# EAGLE design compact (EAGLE 7.1.0)
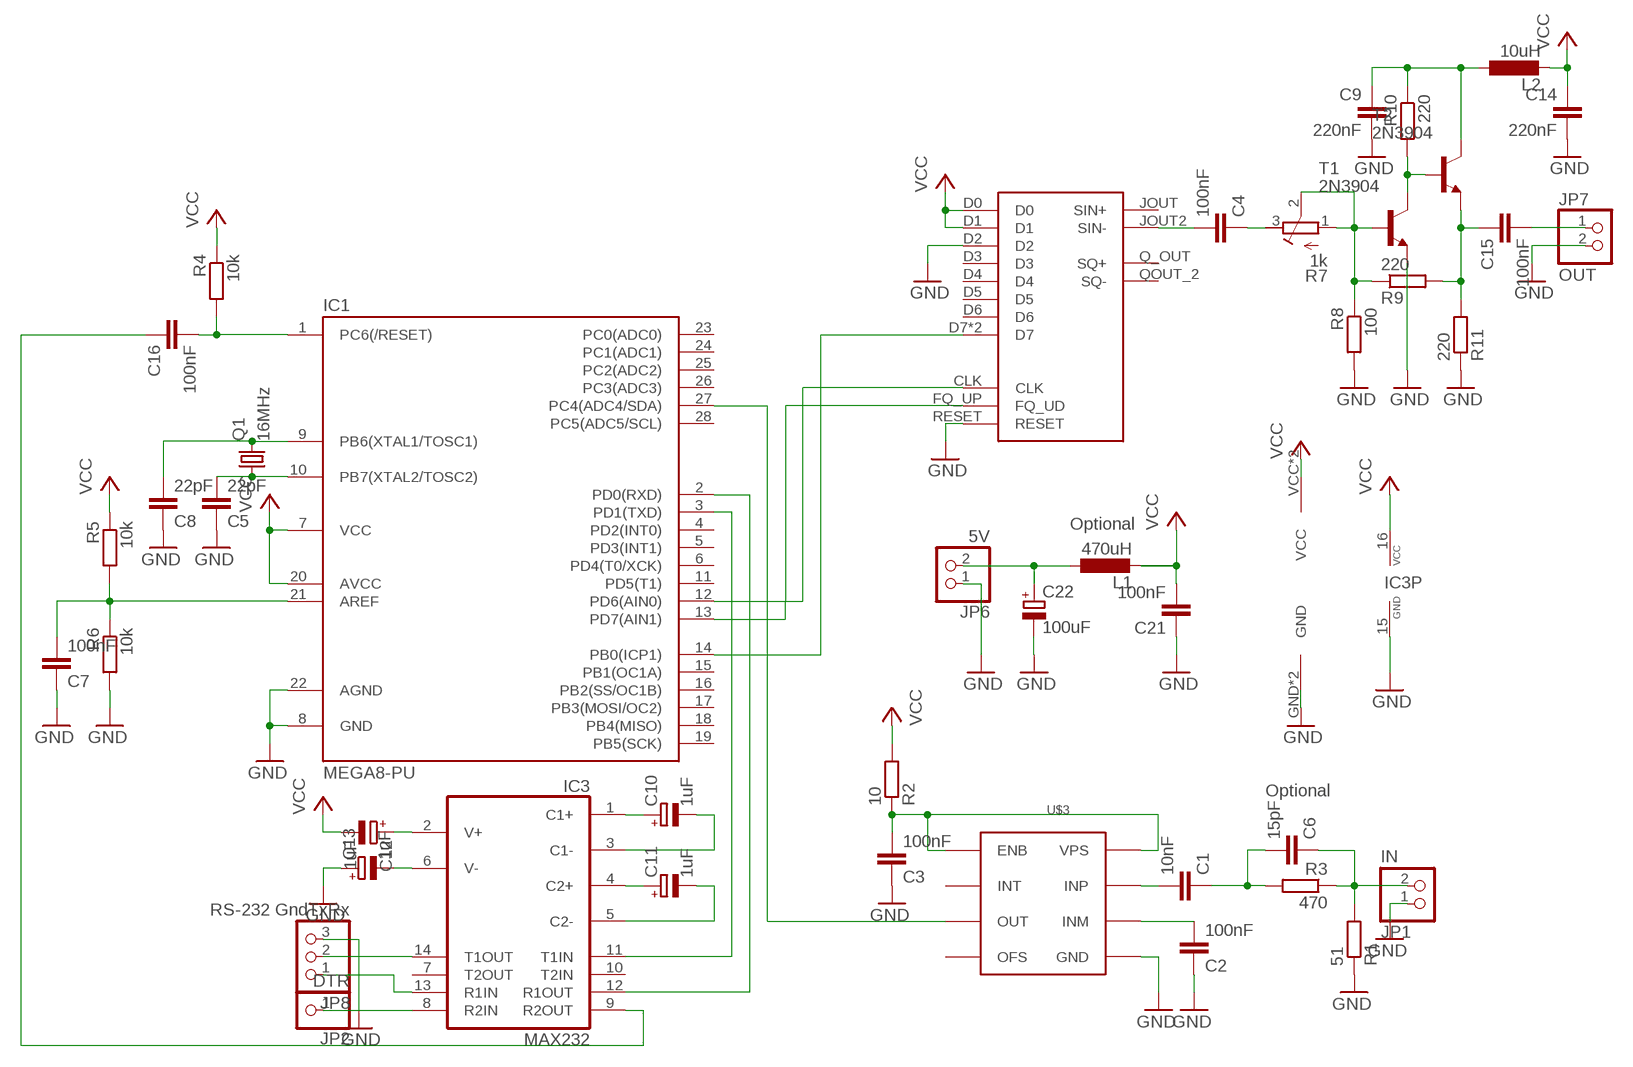
[diagram p0: schematic, sheet 1]

## Parts
C1  10nF  C-EU050-025X075  [C050-025X075]
C2  100nF  C-EU025-025X050  [C025-025X050]
C3  100nF  C-EU025-025X050  [C025-025X050]
C4  100nF  C-EU025-025X050  [C025-025X050]
C5  22pF  C-EU102-043X133  [C102-043X133]
C6  15pF  C-EU025-025X050  [C025-025X050]
C7  100nF  C-EU025-025X050  [C025-025X050]
C8  22pF  C-EU025-025X050  [C025-025X050]
C9  220nF  C-EU025-025X050  [C025-025X050]
C10  1uF  CPOL-EUE2.5-6  [E2,5-6]
C11  1uF  CPOL-EUE2.5-5  [E2,5-5]
C12  1uF  CPOL-EUE2.5-5  [E2,5-5]
C13  1uF  CPOL-EUE5-5  [E5-5]
C14  220nF  C-EU025-025X050  [C025-025X050]
C15  100nF  C-EU050-025X075  [C050-025X075]
C16  100nF  C-EU075-032X103  [C075-032X103]
C21  100nF  C-EU025-025X050  [C025-025X050]
C22  100uF  CPOL-EUE2.5-6  [E2,5-6]
IC1  MEGA8-PU  [DIL28-3]
IC3  MAX232  [DIL16]
JP1  IN  PINHD-1X2  [1X02]
JP2  DTR  PINHD-1X1  [1X01]
JP6  5V  PINHD-1X2  [1X02]
JP7  OUT  PINHD-1X2  [1X02]
JP8  RS-232 GndTxRx  PINHD-1X3  [1X03]
L1  470uH  L-EU0207/5V  [0207/5V]
L2  10uH  L-EU0204/7  [0204/7]
Q1  16MHz  CRYSTALHC49U-V  [HC49U-V]
R1  51  R-EU_0204/2V  [0204V]
R2  10  R-EU_0204/5  [0204/5]
R3  470  R-EU_0204/2V  [0204V]
R4  10k  R-EU_0204/5  [0204/5]
R5  10k  R-EU_0204/2V  [0204V]
R6  10k  R-EU_0204/5  [0204/5]
R7  1k  R-TRIMM74W  [RTRIM74W]
R8  100  R-EU_0204/2V  [0204V]
R9  220  R-EU_0204/2V  [0204V]
R10  220  R-EU_0204/2V  [0204V]
R11  220  R-EU_0204/2V  [0204V]
T1  2N3904  2N3904-NPN-TO92-EBC  [TO92-EBC]
T2  2N3904  2N3904-NPN-TO92-EBC  [TO92-EBC]
U$1  DDS-1  [DDS-1]
U$3  AD8307  [DIL08]

## Nets
GND: C2.1 C3.1 C5.1 C7.1 C8.1 C9.2 C13.+ C14.2 C21.1 C22.- IC1.8(GND) IC1.22(AGND) IC3.15(GND) JP1.1 JP6.1 JP7.2 JP8.3 R1.1 R6.2 R8.2 R11.1 T1.E U$1.D2 U$1.GND U$1.GND2(GND) U$1.RESET U$3.2(GND)
N$1: C4.2 U$1.JOUT2(SIN-)
N$2: C6.1 JP1.2 R1.2 R3.1
N$3: C1.2 U$3.8(INP)
N$4: C2.2 U$3.1(INM)
N$5: C5.2 IC1.10(PB7(XTAL2/TOSC2)) Q1.1
N$6: C8.2 IC1.9(PB6(XTAL1/TOSC1)) Q1.2
N$7: C12.+ IC3.2(V+)
N$8: C3.2 R2.1 U$3.6(ENB) U$3.7(VPS)
N$9: IC1.27(PC4(ADC4/SDA)) U$3.4(OUT)
N$10: C22.+ JP6.2 L1.1
N$11: IC3.14(T1OUT) JP8.2
N$12: C1.1 C6.2 R3.2
N$13: C4.1 R7.3(A)
N$14: R7.1(E) R7.2(S) R8.1 R9.1 T1.B
N$15: IC1.13(PD7(AIN1)) U$1.FQ_UP(FQ_UD)
N$16: C13.- IC3.6(V-)
N$17: IC1.3(PD1(TXD)) IC3.11(T1IN)
N$18: IC1.12(PD6(AIN0)) U$1.CLK
N$19: IC1.14(PB0(ICP1)) U$1.D7 U$1.D7_2(D7)
N$20: C9.1 L2.1 R10.1 T2.C
N$21: R10.2 T1.C T2.B
N$22: IC1.2(PD0(RXD)) IC3.12(R1OUT)
N$23: C15.2 JP7.1
N$24: C15.1 R9.2 R11.2 T2.E
N$25: C16.2 IC1.1(PC6(/RESET)) R4.2
N$26: C16.1 IC3.9(R2OUT)
N$27: IC3.8(R2IN) JP2.1
N$29: C7.2 IC1.21(AREF) R5.2 R6.1
N$34: IC3.13(R1IN) JP8.1
N$38: C10.+ IC3.1(C1+)
N$39: C10.- IC3.3(C1-)
N$40: C11.+ IC3.4(C2+)
N$41: C11.- IC3.5(C2-)
VCC: C12.- C14.1 C21.2 IC1.7(VCC) IC1.20(AVCC) IC3.16(VCC) L1.2 L2.2 R2.2 R4.1 R5.1 U$1.D0 U$1.D1 U$1.VCC U$1.VCC2(VCC)
Unconnected: IC1.4(PD2(INT0)) IC1.5(PD3(INT1)) IC1.6(PD4(T0/XCK)) IC1.11(PD5(T1)) IC1.15(PB1(OC1A)) IC1.16(PB2(SS/OC1B)) IC1.17(PB3(MOSI/OC2)) IC1.18(PB4(MISO)) IC1.19(PB5(SCK)) IC1.23(PC0(ADC0)) IC1.24(PC1(ADC1)) IC1.25(PC2(ADC2)) IC1.26(PC3(ADC3)) IC1.28(PC5(ADC5/SCL)) IC3.7(T2OUT) IC3.10(T2IN) U$1.D3 U$1.D4 U$1.D5 U$1.D6 U$1.JOUT(SIN+) U$1.Q_OUT(SQ+) U$1.QOUT_2(SQ-) U$3.3(OFS) U$3.5(INT)

## Notes on the sheet
- Optional
- Optional

## Library data of the parts
C1-C9 C14-C16 C21 = rcl:C-EU: CAPACITOR, European symbol
C10-C13 C22 = rcl:CPOL-EU: POLARIZED CAPACITOR, European symbol
IC1 = avr-6:MEGA8-PU
IC3 = maxim:MAX232: RS232 TRANSCEIVER; MF: MAXIM; MPN: MAX232ACPE+; OC_FARNELL: 9723773; OC_NEWARK: 68K4544
JP1 JP6 JP7 = pinhead:PINHD-1X2: PIN HEADER
JP2 = pinhead:PINHD-1X1: PIN HEADER
JP8 = pinhead:PINHD-1X3: PIN HEADER
L1 L2 = rcl:L-EU: INDUCTOR, European symbol
Q1 = crystal:CRYSTAL: CRYSTAL; OC_FARNELL: 1666969; OC_NEWARK: unknown
R1-R6 R8-R11 = rcl:R-EU_: RESISTOR, European symbol
R7 = resistor:R-TRIMM: Trimm resistor
T1 T2 = transistor-neu-to92:*-NPN-: NPN Transistror
U$1 = minikits:DDS-1: DDS-1 Module DDS module by minikits.au
U$3 = -- Eigene:AD8307

## Board
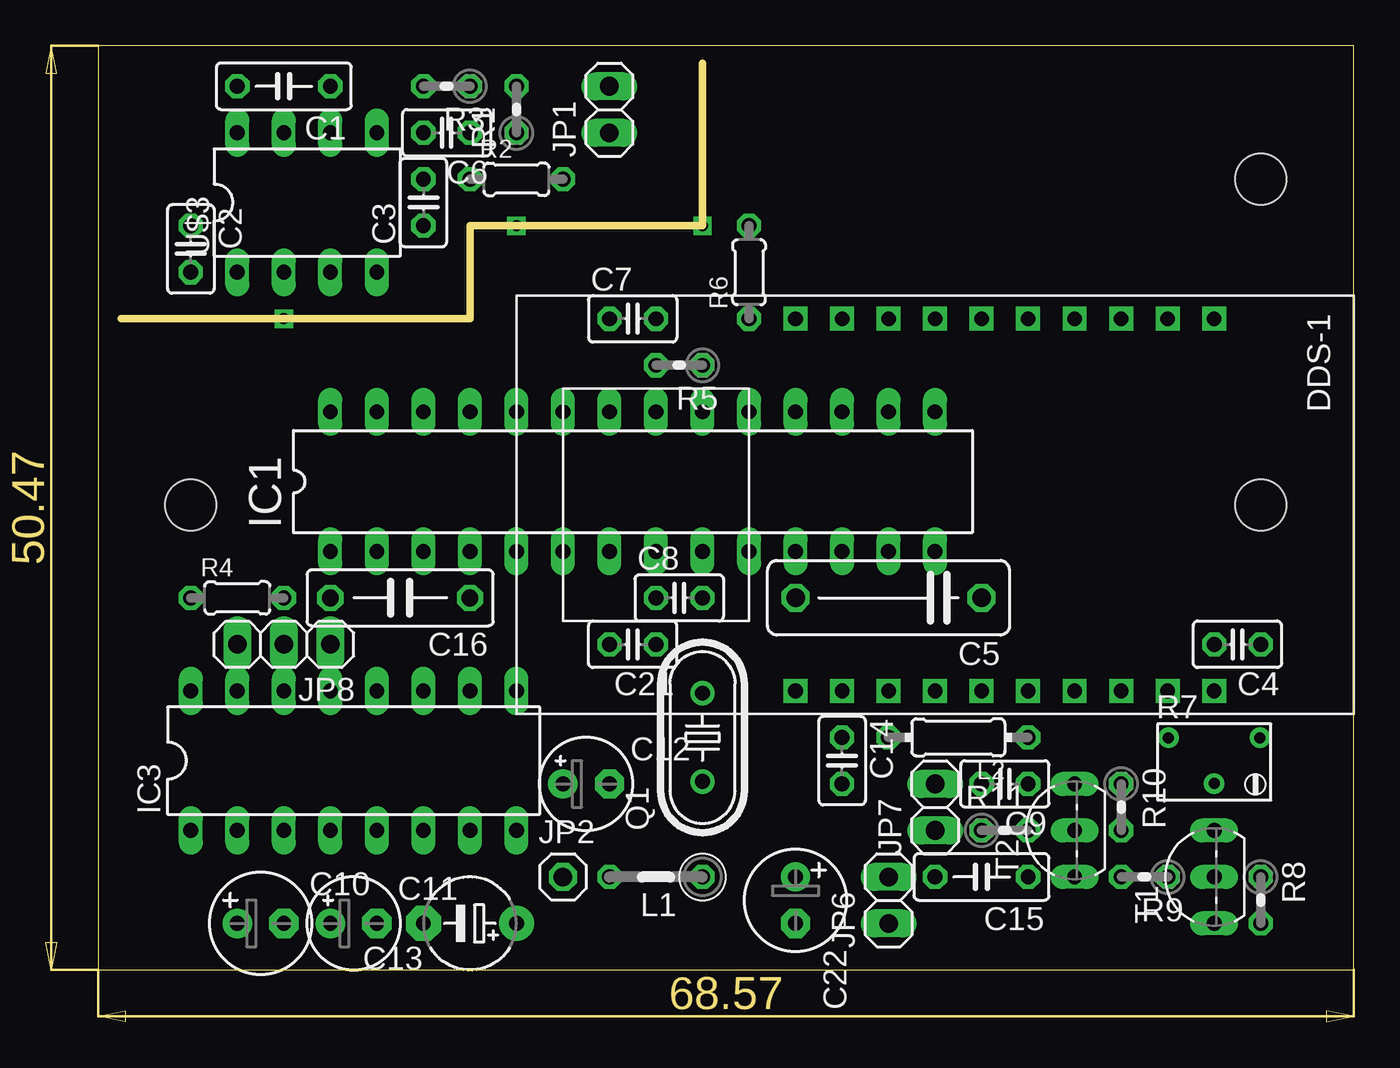
[diagram p1: board, top side]
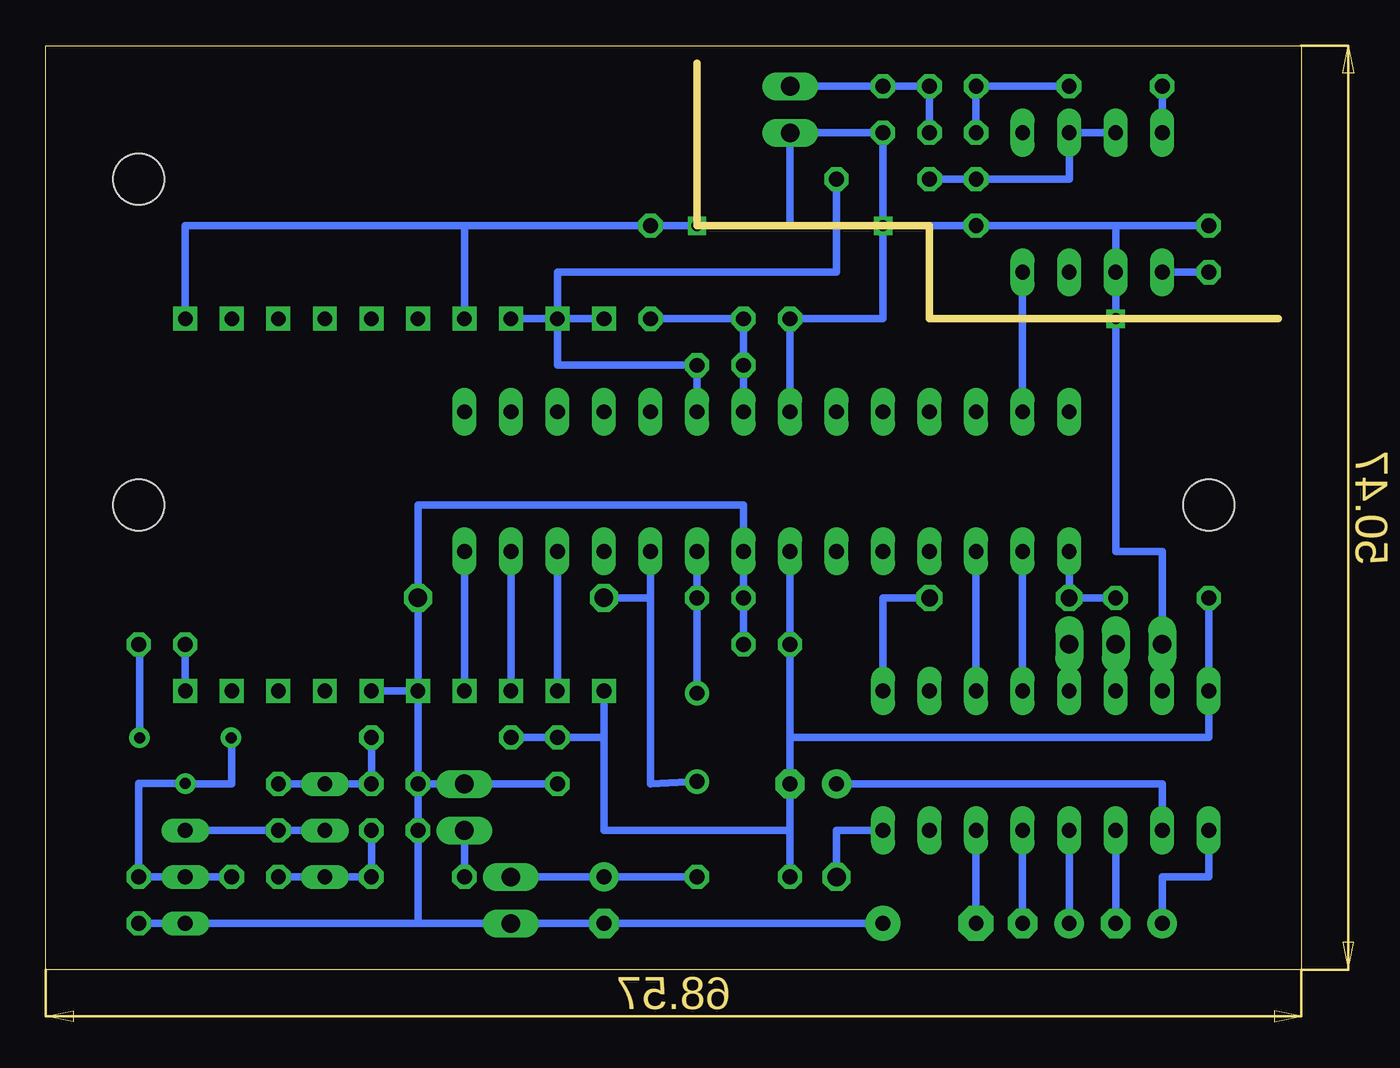
[diagram p2: board, bottom side, seen from below]

Size 68.57 x 50.47 mm. Coordinates in mm from the lower left corner, seen from the top.
Outline: 1.26,35.56 20.31,35.56 20.31,40.64 33.01,40.64 33.01,49.53
Outline: 68.57,0 68.57,50.47 0,50.47 0,0 68.57,0
Copper layers (1*16): Top 0.035mm / dielectric 1.5mm / Bottom 0.035mm
Design rules "default": minimum track width 10mil, minimum drill 24mil, track to track 8mil, track to pad 8mil, pad to pad 8mil, via to via 8mil, smd to smd 8mil, copper to edge 40mil, drill to drill 8mil, minimum pad ring 10mil, minimum via ring 8mil, stop-mask expansion 4mil, vias tented up to drill 0mil, thermal gap 10mil
Holes 2.8 mm at 63.49,25.4 63.49,43.18 5.07,25.4

### Footprints (pad centres in the part's own frame; a part is rotated, then mirrored left to right if it is on the bottom)
C050-025X075 = drill 0.813 octagon: 1 -2.54,0; 2 2.54,0
C025-025X050 = drill 0.813 octagon: 1 -1.27,0; 2 1.27,0
C102-043X133 = drill 1.016 octagon: 1 -5.08,0; 2 5.08,0
E2,5-6 = drill 0.813 pad 1.6: + -1.27,0 | drill 0.813 pad 1.6 octagon: - 1.27,0
E2,5-5 = drill 0.813 pad 1.6: + -1.27,0 | drill 0.813 pad 1.6 octagon: - 1.27,0
E5-5 = drill 0.813 pad 1.905: + -2.54,0 | drill 0.813 pad 1.905 octagon: - 2.54,0
C075-032X103 = drill 0.914 octagon: 1 -3.81,0; 2 3.81,0
DIL28-3 = drill 0.813 long: 1 -16.51,-3.81; 2 -13.97,-3.81; 3 -11.43,-3.81; 4 -8.89,-3.81; 5 -6.35,-3.81; 6 -3.81,-3.81; 7 -1.27,-3.81; 8 1.27,-3.81; 9 3.81,-3.81; 10 6.35,-3.81; 11 8.89,-3.81; 12 11.43,-3.81; 13 13.97,-3.81; 14 16.51,-3.81; 15 16.51,3.81; 16 13.97,3.81; 17 11.43,3.81; 18 8.89,3.81; 19 6.35,3.81; 20 3.81,3.81; 21 1.27,3.81; 22 -1.27,3.81; 23 -3.81,3.81; 24 -6.35,3.81; 25 -8.89,3.81; 26 -11.43,3.81; 27 -13.97,3.81; 28 -16.51,3.81
DIL16 = drill 0.813 long: 1 -8.89,-3.81; 2 -6.35,-3.81; 3 -3.81,-3.81; 4 -1.27,-3.81; 5 1.27,-3.81; 6 3.81,-3.81; 7 6.35,-3.81; 8 8.89,-3.81; 9 8.89,3.81; 10 6.35,3.81; 11 3.81,3.81; 12 1.27,3.81; 13 -1.27,3.81; 14 -3.81,3.81; 15 -6.35,3.81; 16 -8.89,3.81
1X02 = drill 1.016 long: 1 -1.27,0; 2 1.27,0
1X01 = drill 1.016 octagon: 1 0,0
1X03 = drill 1.016 long: 1 -2.54,0; 2 0,0; 3 2.54,0
0207/5V = drill 0.813 octagon: 1 -2.54,0; 2 2.54,0
0204/7 = drill 0.813 octagon: 1 -3.81,0; 2 3.81,0
HC49U-V = drill 0.813: 1 -2.413,0; 2 2.413,0
0204V = drill 0.813 octagon: 1 -1.27,0; 2 1.27,0
0204/5 = drill 0.813 octagon: 1 -2.54,0; 2 2.54,0
RTRIM74W = drill 0.61: 1 -1.25,-2.5; 2 1.25,0; 3 -1.25,2.5
TO92-EBC = drill 0.813 long: B 0,-1.27; C 2.54,-1.27; E -2.54,-1.27
DDS-1 = drill 0.8 square: CLK -11.43,7.62; D0 8.89,7.62; D1 8.89,5.08; D2 8.89,2.54; D3 8.89,0; D4 8.89,-2.54; D5 8.89,-5.08; D6 8.89,-7.62; D7 -11.43,2.54; D7_2 8.89,-10.16; FQ_UP -11.43,5.08; GND -11.43,-2.54; GND2 8.89,-12.7; JOUT -11.43,-10.16; JOUT2 -11.43,-12.7; Q_OUT -11.43,-5.08; QOUT_2 -11.43,-7.62; RESET -11.43,0; VCC -11.43,10.16; VCC2 8.89,10.16
DIL08 = drill 0.813 long: 1 -3.81,-3.81; 2 -1.27,-3.81; 3 1.27,-3.81; 4 3.81,-3.81; 5 3.81,3.81; 6 1.27,3.81; 7 -1.27,3.81; 8 -3.81,3.81

### Placement (x,y rotation side)
C1  10.15,48.26 180 top
C2  5.07,39.37 270 top
C3  17.77,41.91 90 top
C4  62.22,17.78 180 top
C5  43.17,20.32 180 top
C6  19.04,45.72 180 top
C7  29.2,35.56 0 top
C8  31.74,20.32 0 top
C9  49.52,10.16 180 top
C10  8.88,2.54 0 top
C11  13.96,2.54 0 top
C12  26.66,10.16 0 top
C13  20.31,2.54 180 top
C14  40.63,11.43 270 top
C15  48.25,5.08 180 top
C16  16.5,20.32 180 top
C21  29.2,17.78 180 top
C22  38.09,3.81 270 top
IC1  29.2,26.67 0 top
IC3  13.96,11.43 0 top
JP1  27.93,46.99 90 top
JP2  25.39,5.08 0 top
JP6  43.17,3.81 90 top
JP7  45.71,8.89 90 top
JP8  10.15,17.78 180 top
L1  30.47,5.08 180 top
L2  46.98,12.7 180 top
Q1  33.01,12.7 90 top
R1  22.85,46.99 90 top
R2  22.85,43.18 0 top
R3  19.04,48.26 180 top
R4  7.61,20.32 0 top
R5  31.74,33.02 180 top
R6  35.55,38.1 90 top
R7  60.95,11.43 270 top
R8  63.49,3.81 270 top
R9  57.14,5.08 180 top
R10  55.87,8.89 270 top
R11  49.52,7.62 0 top
T1  59.68,5.08 90 top
T2  52.06,7.62 90 top
U$1  48.25,26.67 90 top
U$3  11.42,41.91 0 top

### Tracks (layer width: path | path; a pad name or v marks a point on that pad's centre or on a via)
GND  (via drill 0.6)
  Bottom 0.406: v22.85,40.64 R1.1 JP1.1 27.93,40.64 | v22.85,40.64 22.85,35.56 C7.1 IC1.22 | 10.15,40.64 C3.1 v22.85,40.64 | 10.15,40.64 U$3.2 v10.15,35.56 10.15,22.86 7.61,22.86 JP8.3 IC3.15 | 45.71,40.64 R6.2 | R6.2 v33.01,40.64 | v33.01,40.64 27.93,40.64 | C13.+ 27.93,2.54 29.2,2.54 30.47,2.54 C22.- JP6.1 48.25,2.54 | R6.2 v33.01,40.64 | v33.01,40.64 27.93,40.64 | C21.1 C8.1 IC1.8 30.47,25.4 48.25,25.4 C5.1 U$1.RESET | C2.1 10.15,40.64 | C14.2 JP7.2 C9.2 | 48.25,2.54 R11.1 C9.2 | R8.2 T1.E 48.25,2.54 | C9.2 U$1.RESET | U$1.RESET U$1.GND | U$1.D2 45.71,40.64 | 45.71,40.64 60.95,40.64 U$1.GND2
N$1
  Bottom 0.406: U$1.JOUT2 C4.2
N$2
  Bottom 0.406: C6.1 R3.1 R1.2 JP1.2
N$3
  Bottom 0.406: U$3.8 C1.2
N$4
  Bottom 0.406: C2.2 U$3.1
N$5
  Bottom 0.406: IC1.10 35.55,20.32 | 35.55,20.32 35.55,10.16 Q1.1 | C5.2 35.55,20.32
N$6
  Bottom 0.406: Q1.2 C8.2 IC1.9
N$7
  Bottom 0.406: IC3.2 7.61,10.16 C12.+
N$8
  Bottom 0.406: U$3.7 U$3.6 12.69,43.18 C3.2 R2.1
N$9
  Bottom 0.406: IC1.27 U$3.4
N$10
  Bottom 0.406: JP6.2 C22.+ L1.1
N$11
  Bottom 0.406: IC3.14 JP8.2
N$12
  Bottom 0.406: C1.1 R3.2 C6.2
N$13
  Bottom 0.406: C4.1 63.45,17.78 R7.3
N$14
  Bottom 0.406: T1.B R9.1 R8.1 63.49,10.18 R7.2 60.95,10.16 58.41,10.16 58.41,12.68 R7.1
N$15
  Bottom 0.406: IC1.13 U$1.FQ_UP
N$16
  Bottom 0.406: C13.- IC3.6
N$17
  Bottom 0.406: IC1.3 IC3.11
N$18
  Bottom 0.406: IC1.12 U$1.CLK
N$19
  Bottom 0.406: IC1.14 U$1.D7
N$20
  Bottom 0.406: R10.1 T2.C C9.1 L2.1
N$21
  Bottom 0.406: T2.B R10.2 T1.C
N$22
  Bottom 0.406: IC3.12 IC1.2
N$23
  Bottom 0.406: JP7.1 C15.2
N$24
  Bottom 0.406: C15.1 R11.2 C15.1 | C15.1 T2.E R9.2
N$25
  Bottom 0.406: R4.2 C16.2 IC1.1
N$26
  Bottom 0.406: C16.1 22.85,20.32 IC3.9
N$27
  Bottom 0.406: IC3.8 25.39,7.62 JP2.1
N$29
  Bottom 0.406: R6.1 C7.2 R5.2 IC1.21
N$34
  Bottom 0.406: JP8.1 IC3.13
N$38
  Bottom 0.406: C10.+ 7.61,5.08 5.07,5.08 IC3.1
N$39
  Bottom 0.406: IC3.3 C10.-
N$40
  Bottom 0.406: C11.+ IC3.4
N$41
  Bottom 0.406: IC3.5 C11.-
VCC
  Bottom 0.406: R2.2 25.39,38.1 35.55,38.1 38.09,38.1 40.63,38.1 U$1.D0 | 27.93,20.32 IC1.7 27.93,20.32 | 27.93,20.32 C21.2 | C21.2 27.93,20.32 | IC3.16 5.07,12.7 | 5.07,12.7 R4.1 | 27.93,12.7 26.66,12.7 5.07,12.7 | 27.93,12.7 C12.- 27.93,7.62 | L1.2 27.93,7.62 | 38.09,12.7 38.09,7.62 27.93,7.62 | C21.2 27.93,20.32 | 27.93,20.32 27.93,12.7 | IC1.20 R5.1 38.09,33.02 40.63,33.02 U$1.D0 | 38.09,12.7 C14.1 L2.2 | U$1.VCC2 U$1.D0 | U$1.D0 U$1.D1 | U$1.VCC 38.09,12.7